# EAGLE design LogicBoard (EAGLE 9.6.2)

## Sheet 1 of 3
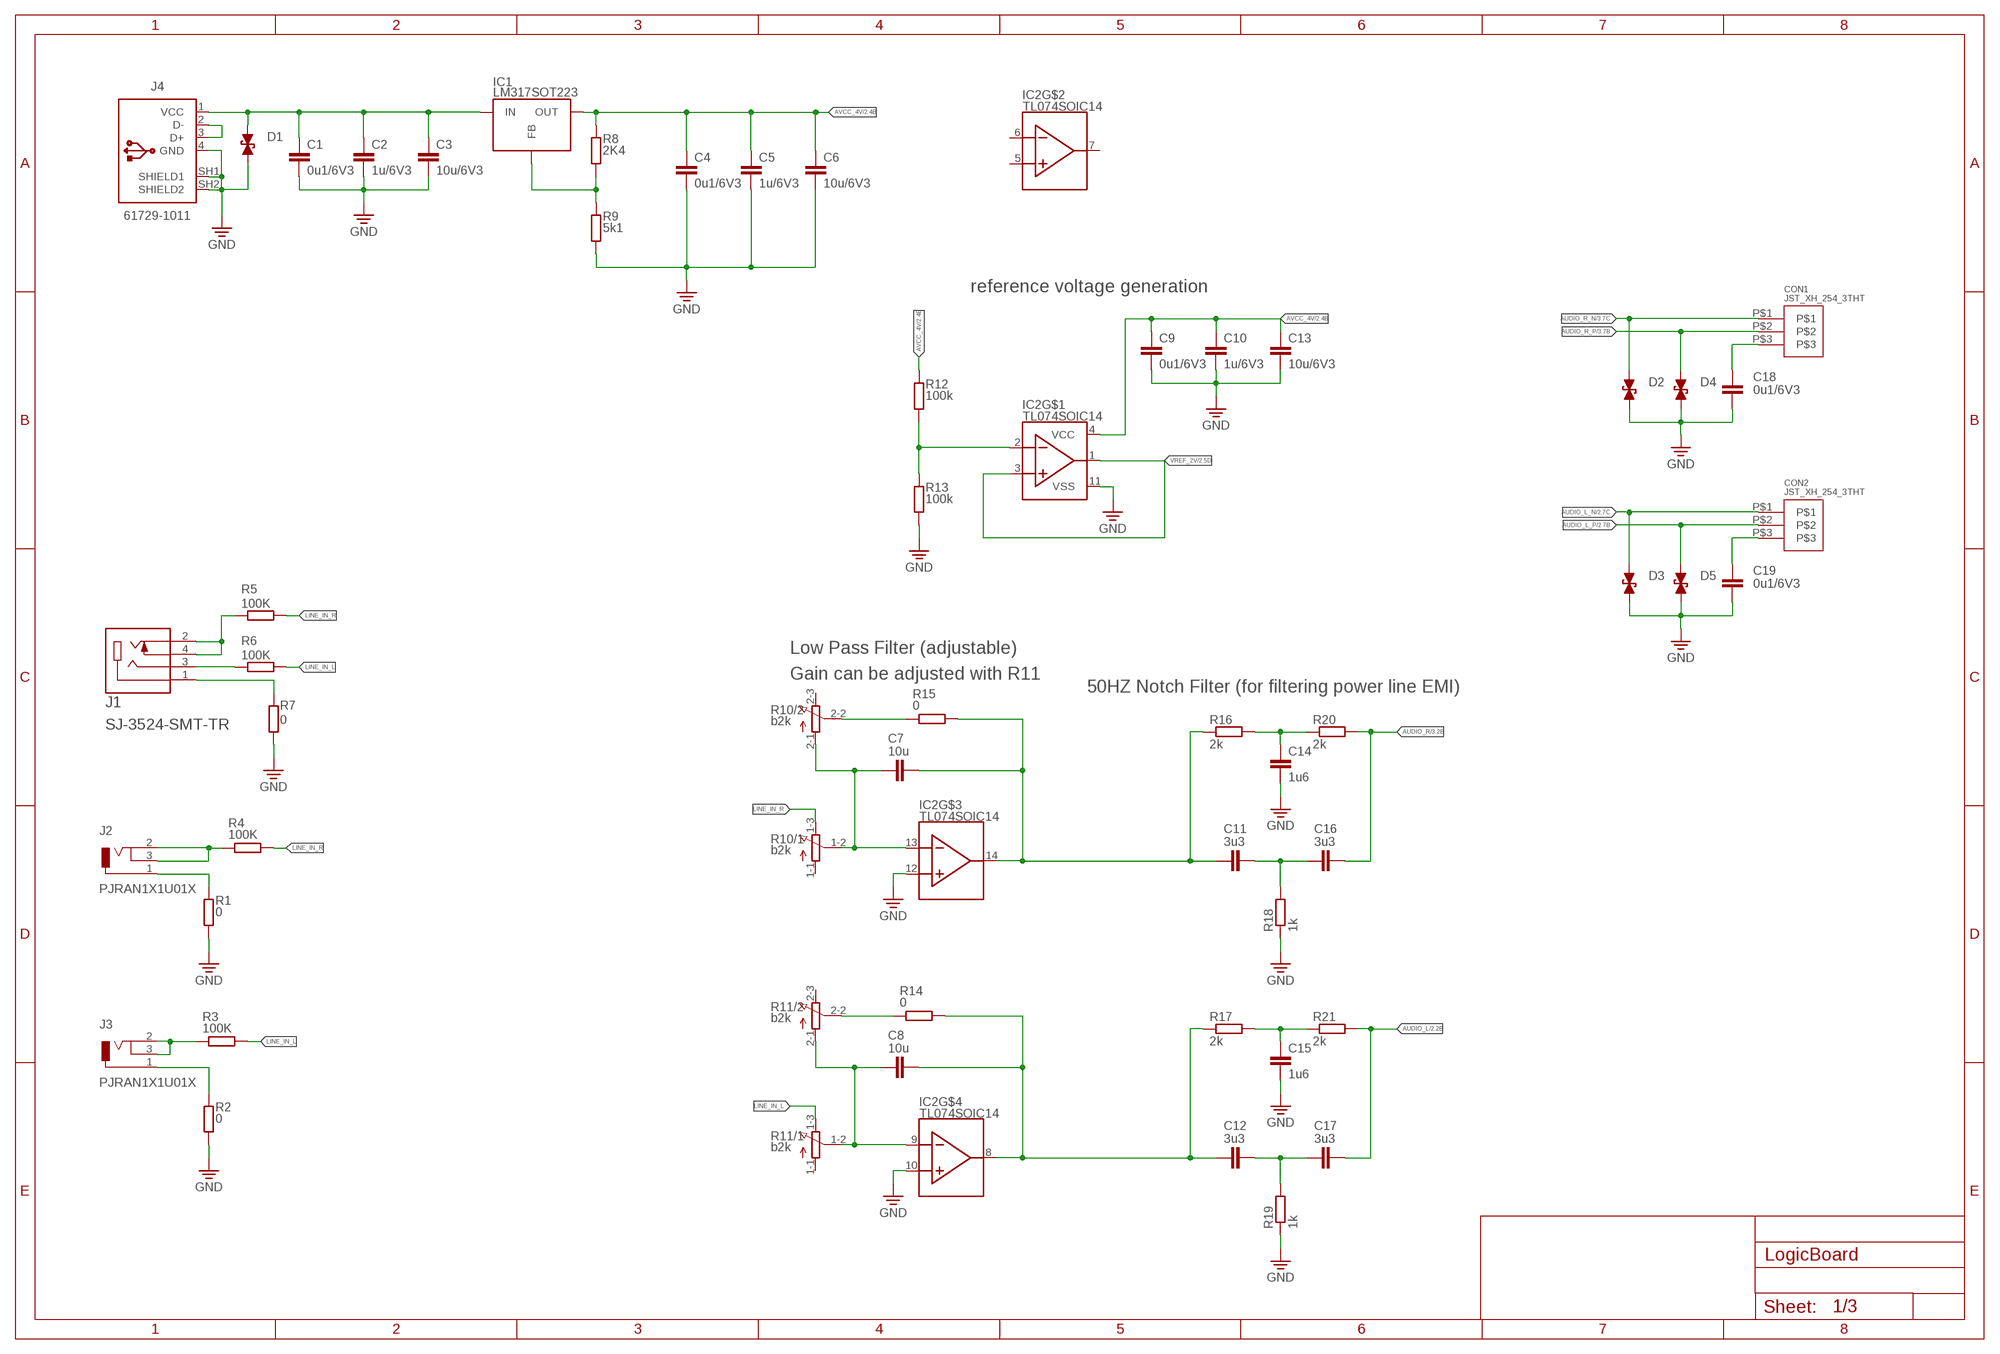
[diagram p0: schematic, sheet 1]

### Parts
C1  0u1/6V3  C-EUC1206  [C1206]
C2  1u/6V3  C-EUC1206  [C1206]
C3  10u/6V3  C-EUC1206  [C1206]
C4  0u1/6V3  C-EUC1206  [C1206]
C5  1u/6V3  C-EUC1206  [C1206]
C6  10u/6V3  C-EUC1206  [C1206]
C7  10u  C-EUC1206  [C1206]
C8  10u  C-EUC1206  [C1206]
C9  0u1/6V3  C-EUC1206  [C1206]
C10  1u/6V3  C-EUC1206  [C1206]
C11  3u3  C-EUC1206  [C1206]
C12  3u3  C-EUC1206  [C1206]
C13  10u/6V3  C-EUC1206  [C1206]
C14  1u6  C-EUC1206  [C1206]
C15  1u6  C-EUC1206  [C1206]
C16  3u3  C-EUC1206  [C1206]
C17  3u3  C-EUC1206  [C1206]
C18  0u1/6V3  C-EUC1206  [C1206]
C19  0u1/6V3  C-EUC1206  [C1206]
CON1  JST_XH_254_3THT  [JST_XH_254_3_THT]
CON2  JST_XH_254_3THT  [JST_XH_254_3_THT]
D1  DIODE_PGB-0603MP  [DIODE_PGB-0603MP]
D2  DIODE_PGB-0603MP  [DIODE_PGB-0603MP]
D3  DIODE_PGB-0603MP  [DIODE_PGB-0603MP]
D4  DIODE_PGB-0603MP  [DIODE_PGB-0603MP]
D5  DIODE_PGB-0603MP  [DIODE_PGB-0603MP]
IC1  LM317SOT223  [SOT230P700X180-4N]
IC2  TL074SOIC14  [SOIC127P600X175-14N]
J1  SJ-3524-SMT-TR  [SJ-3524-SMT-TR]
J2  PJRAN1X1U01X  [PJRAN1X1U01X]
J3  PJRAN1X1U01X  [PJRAN1X1U01X]
J4  61729-1011  [61729-1011BLF]
R1  0  R-EU_R0603  [R0603]
R2  0  R-EU_R0603  [R0603]
R3  100K  R-EU_R0603  [R0603]
R4  100K  R-EU_R0603  [R0603]
R5  100K  R-EU_R0603  [R0603]
R6  100K  R-EU_R0603  [R0603]
R7  0  R-EU_R0603  [R0603]
R8  2K4  R-EU_R0603  [R0603]
R9  5k1  R-EU_R0603  [R0603]
R10  b2k  3RP/1610G  [3RP/1610G]
R11  b2k  3RP/1610G  [3RP/1610G]
R12  100k  R-EU_R0603  [R0603]
R13  100k  R-EU_R0603  [R0603]
R14  0  R-EU_R0603  [R0603]
R15  0  R-EU_R0603  [R0603]
R16  2k  R-EU_R0603  [R0603]
R17  2k  R-EU_R0603  [R0603]
R18  1k  R-EU_R0603  [R0603]
R19  1k  R-EU_R0603  [R0603]
R20  2k  R-EU_R0603  [R0603]
R21  2k  R-EU_R0603  [R0603]

### Nets
AUDIO_L: C17.2 R21.2 ; also sheet 2
AUDIO_L_N: CON2.P$1 D3.2 ; also sheet 2
AUDIO_L_P: CON2.P$2 D5.2 ; also sheet 2
AUDIO_R: C16.2 R20.2 ; also sheet 3
AUDIO_R_N: CON1.P$1 D2.2 ; also sheet 3
AUDIO_R_P: CON1.P$2 D4.2 ; also sheet 3
AVCC_4V: C4.1 C5.1 C6.1 C9.1 C10.1 C13.1 IC1.2(OUT) IC2.4(VCC) R8.2 R12.2 ; also sheet 2,3
GND: C1.2 C2.2 C3.2 C4.2 C5.2 C6.2 C9.2 C10.2 C13.2 C14.2 C15.2 C18.1 C19.1 D1.1 D2.1 D3.1 D4.1 D5.1 IC2.10(IN+) IC2.11(VSS) IC2.12(IN+) J4.4(GND) J4.SH1(SHIELD1) J4.SH2(SHIELD2) R1.2 R2.2 R7.2 R9.1 R13.1 R18.1 R19.1 ; also sheet 2,3
L: J1.3 R6.1
LINE_IN_L: R3.2 R6.2 R11.1-3(/1:E)
LINE_IN_R: R4.2 R5.2 R10.1-3(/1:E)
N$1: C8.1 IC2.9(IN-) R11.1-2(/1:S) R11.2-1(/2:A)
N$2: C7.1 IC2.13(IN-) R10.1-2(/1:S) R10.2-1(/2:A)
N$3: C8.2 C12.1 IC2.8(OUT) R14.2 R17.1
N$4: C7.2 C11.1 IC2.14(OUT) R15.2 R16.1
N$5: C14.1 R16.2 R20.1
N$6: R10.2-2(/2:S) R15.1
N$7: C15.1 R17.2 R21.1
N$8: C11.2 C16.1 R18.2
N$9: C12.2 C17.1 R19.2
N$10: J2.2 J2.3 R4.1
N$11: J3.2 J3.3 R3.1
N$12: IC2.2(IN-) R12.1 R13.2
N$37: C18.2 CON1.P$3
N$38: J4.2(D-) J4.3(D+)
N$39: J3.1 R2.1
N$40: J2.1 R1.1
N$41: C1.1 C2.1 C3.1 D1.2 IC1.3(IN) J4.1(VCC)
N$42: R11.2-2(/2:S) R14.1
N$43: IC1.1(FB) R8.1 R9.2
N$44: C19.2 CON2.P$3
R: J1.2 J1.4 R5.1
SCHIRMUNG: J1.1 R7.1
VREF_2V: IC2.1(OUT) IC2.3(IN+) ; also sheet 2,3
Unconnected: IC2.5(IN+) IC2.6(IN-) IC2.7(OUT) R10.1-1(/1:A) R10.2-3(/2:E) R11.1-1(/1:A) R11.2-3(/2:E)

### Notes on the sheet
- reference voltage generation
- Low Pass Filter (adjustable)
- Gain can be adjusted with R11
- 50HZ Notch Filter (for filtering power line EMI)

## Sheet 2 of 3
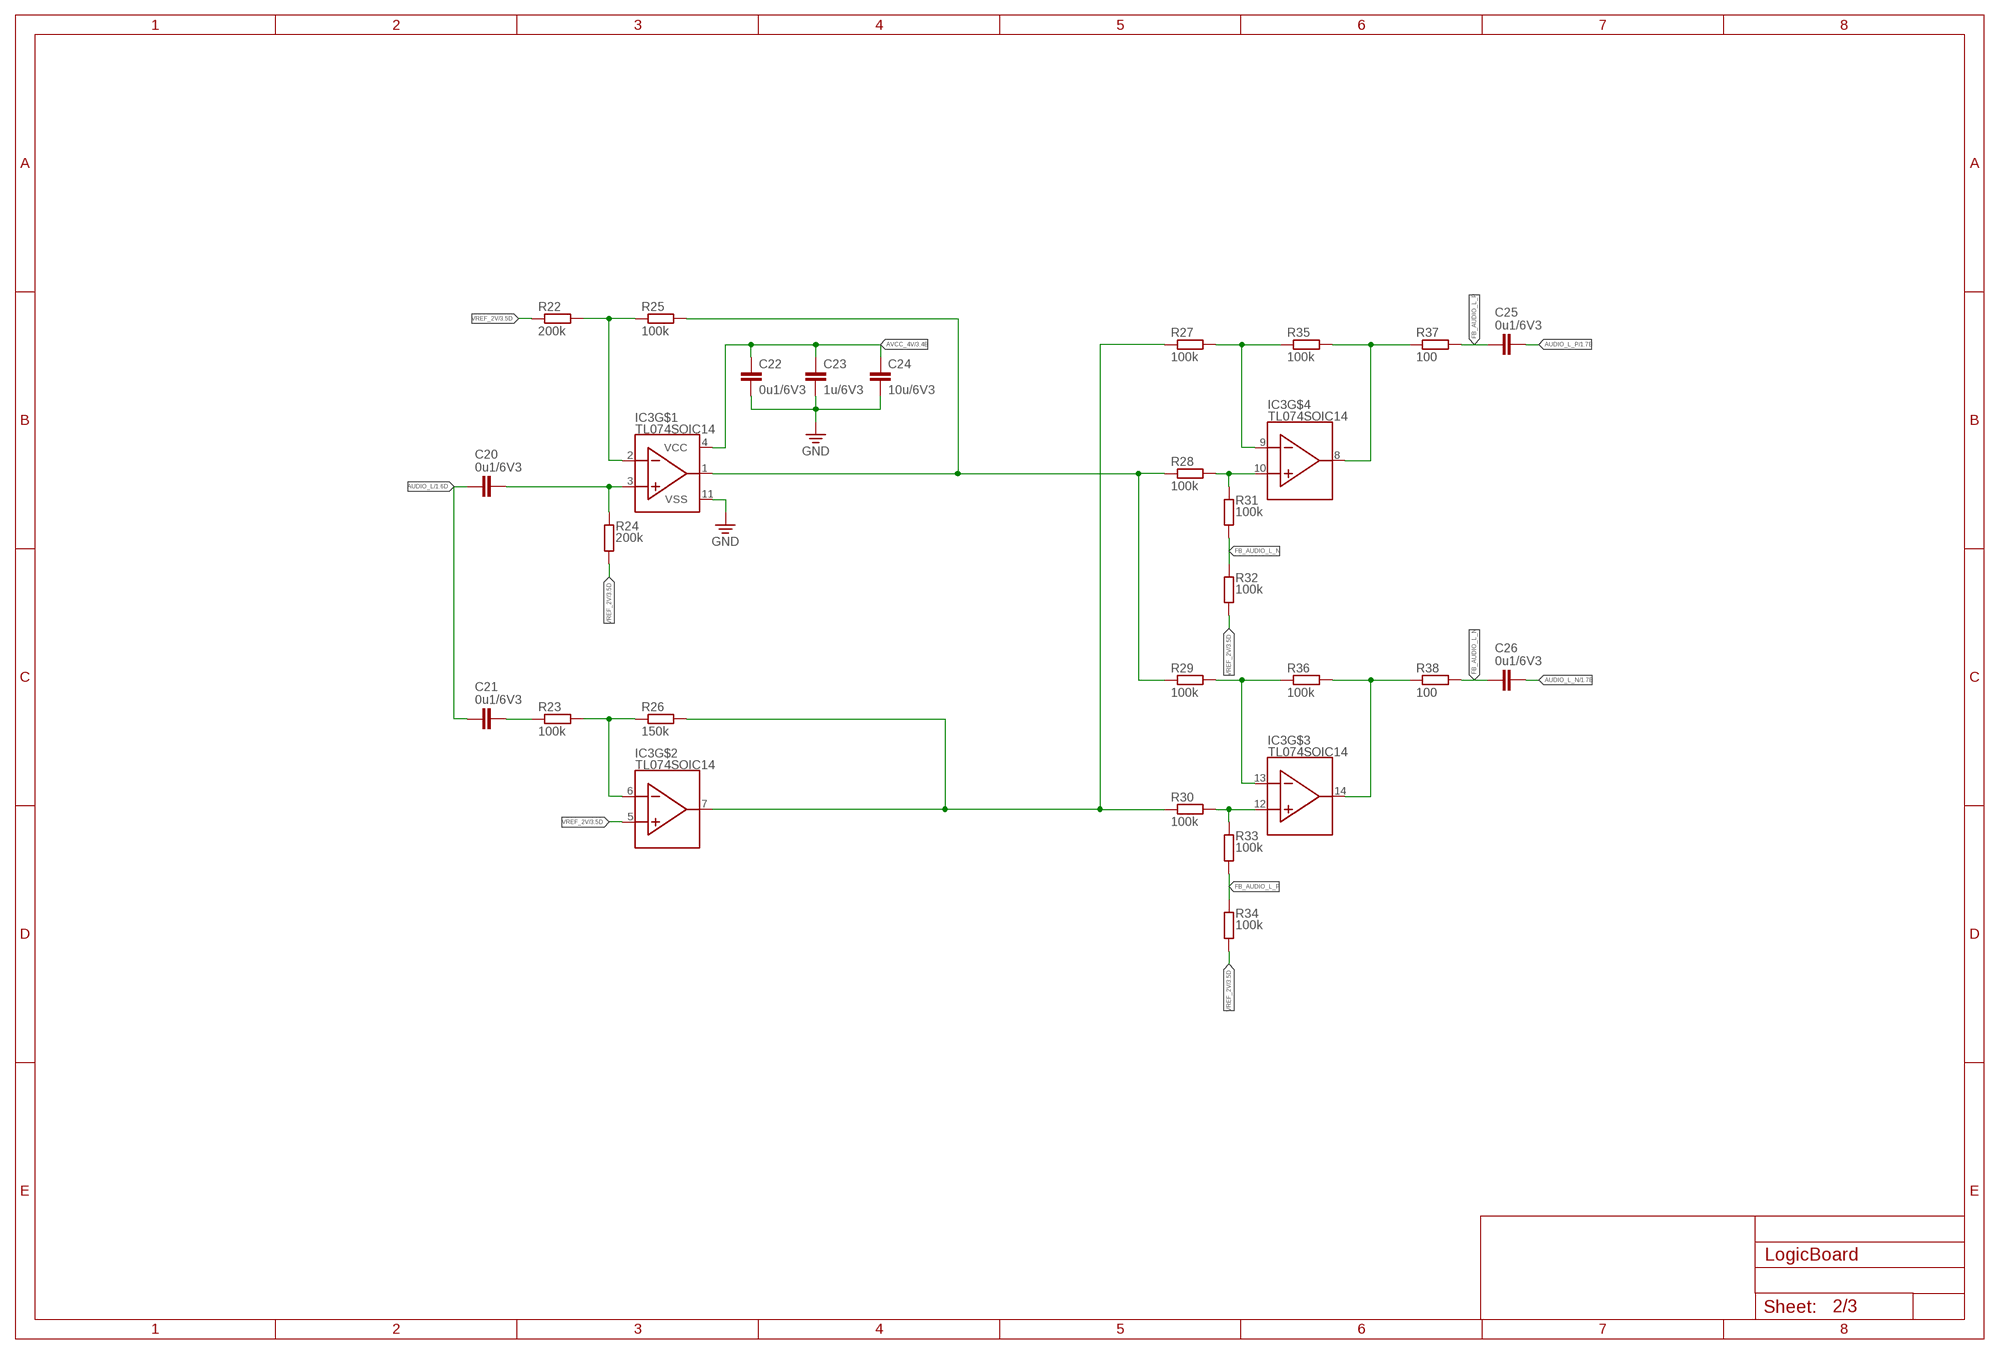
[diagram p1: schematic, sheet 2]

### Parts
C20  0u1/6V3  C-EUC1206  [C1206]
C21  0u1/6V3  C-EUC1206  [C1206]
C22  0u1/6V3  C-EUC1206  [C1206]
C23  1u/6V3  C-EUC1206  [C1206]
C24  10u/6V3  C-EUC1206  [C1206]
C25  0u1/6V3  C-EUC1206  [C1206]
C26  0u1/6V3  C-EUC1206  [C1206]
IC3  TL074SOIC14  [SOIC127P600X175-14N]
R22  200k  R-EU_R0603  [R0603]
R23  100k  R-EU_R0603  [R0603]
R24  200k  R-EU_R0603  [R0603]
R25  100k  R-EU_R0603  [R0603]
R26  150k  R-EU_R0603  [R0603]
R27  100k  R-EU_R0603  [R0603]
R28  100k  R-EU_R0603  [R0603]
R29  100k  R-EU_R0603  [R0603]
R30  100k  R-EU_R0603  [R0603]
R31  100k  R-EU_R0603  [R0603]
R32  100k  R-EU_R0603  [R0603]
R33  100k  R-EU_R0603  [R0603]
R34  100k  R-EU_R0603  [R0603]
R35  100k  R-EU_R0603  [R0603]
R36  100k  R-EU_R0603  [R0603]
R37  100  R-EU_R0603  [R0603]
R38  100  R-EU_R0603  [R0603]

### Nets
AUDIO_L: C20.2 C21.2 ; also sheet 1
AUDIO_L_N: C26.1 ; also sheet 1
AUDIO_L_P: C25.1 ; also sheet 1
AVCC_4V: C22.1 C23.1 C24.1 IC3.4(VCC) ; also sheet 1,3
FB_AUDIO_L_N: C26.2 R31.2 R32.1 R38.2
FB_AUDIO_L_P: C25.2 R33.2 R34.1 R37.2
GND: C22.2 C23.2 C24.2 IC3.11(VSS) ; also sheet 1,3
N$13: IC3.6(IN-) R23.2 R26.1
N$14: IC3.2(IN-) R22.2 R25.1
N$15: IC3.9(IN-) R27.2 R35.1
N$16: IC3.8(OUT) R35.2 R37.1
N$17: IC3.10(IN+) R28.2 R31.1
N$18: IC3.13(IN-) R29.2 R36.1
N$19: IC3.14(OUT) R36.2 R38.1
N$20: IC3.12(IN+) R30.2 R33.1
N$21: IC3.1(OUT) R25.2 R28.1 R29.1
N$22: IC3.7(OUT) R26.2 R27.1 R30.1
N$23: C20.1 IC3.3(IN+) R24.2
N$24: C21.1 R23.1
VREF_2V: IC3.5(IN+) R22.1 R24.1 R32.2 R34.2 ; also sheet 1,3

## Sheet 3 of 3
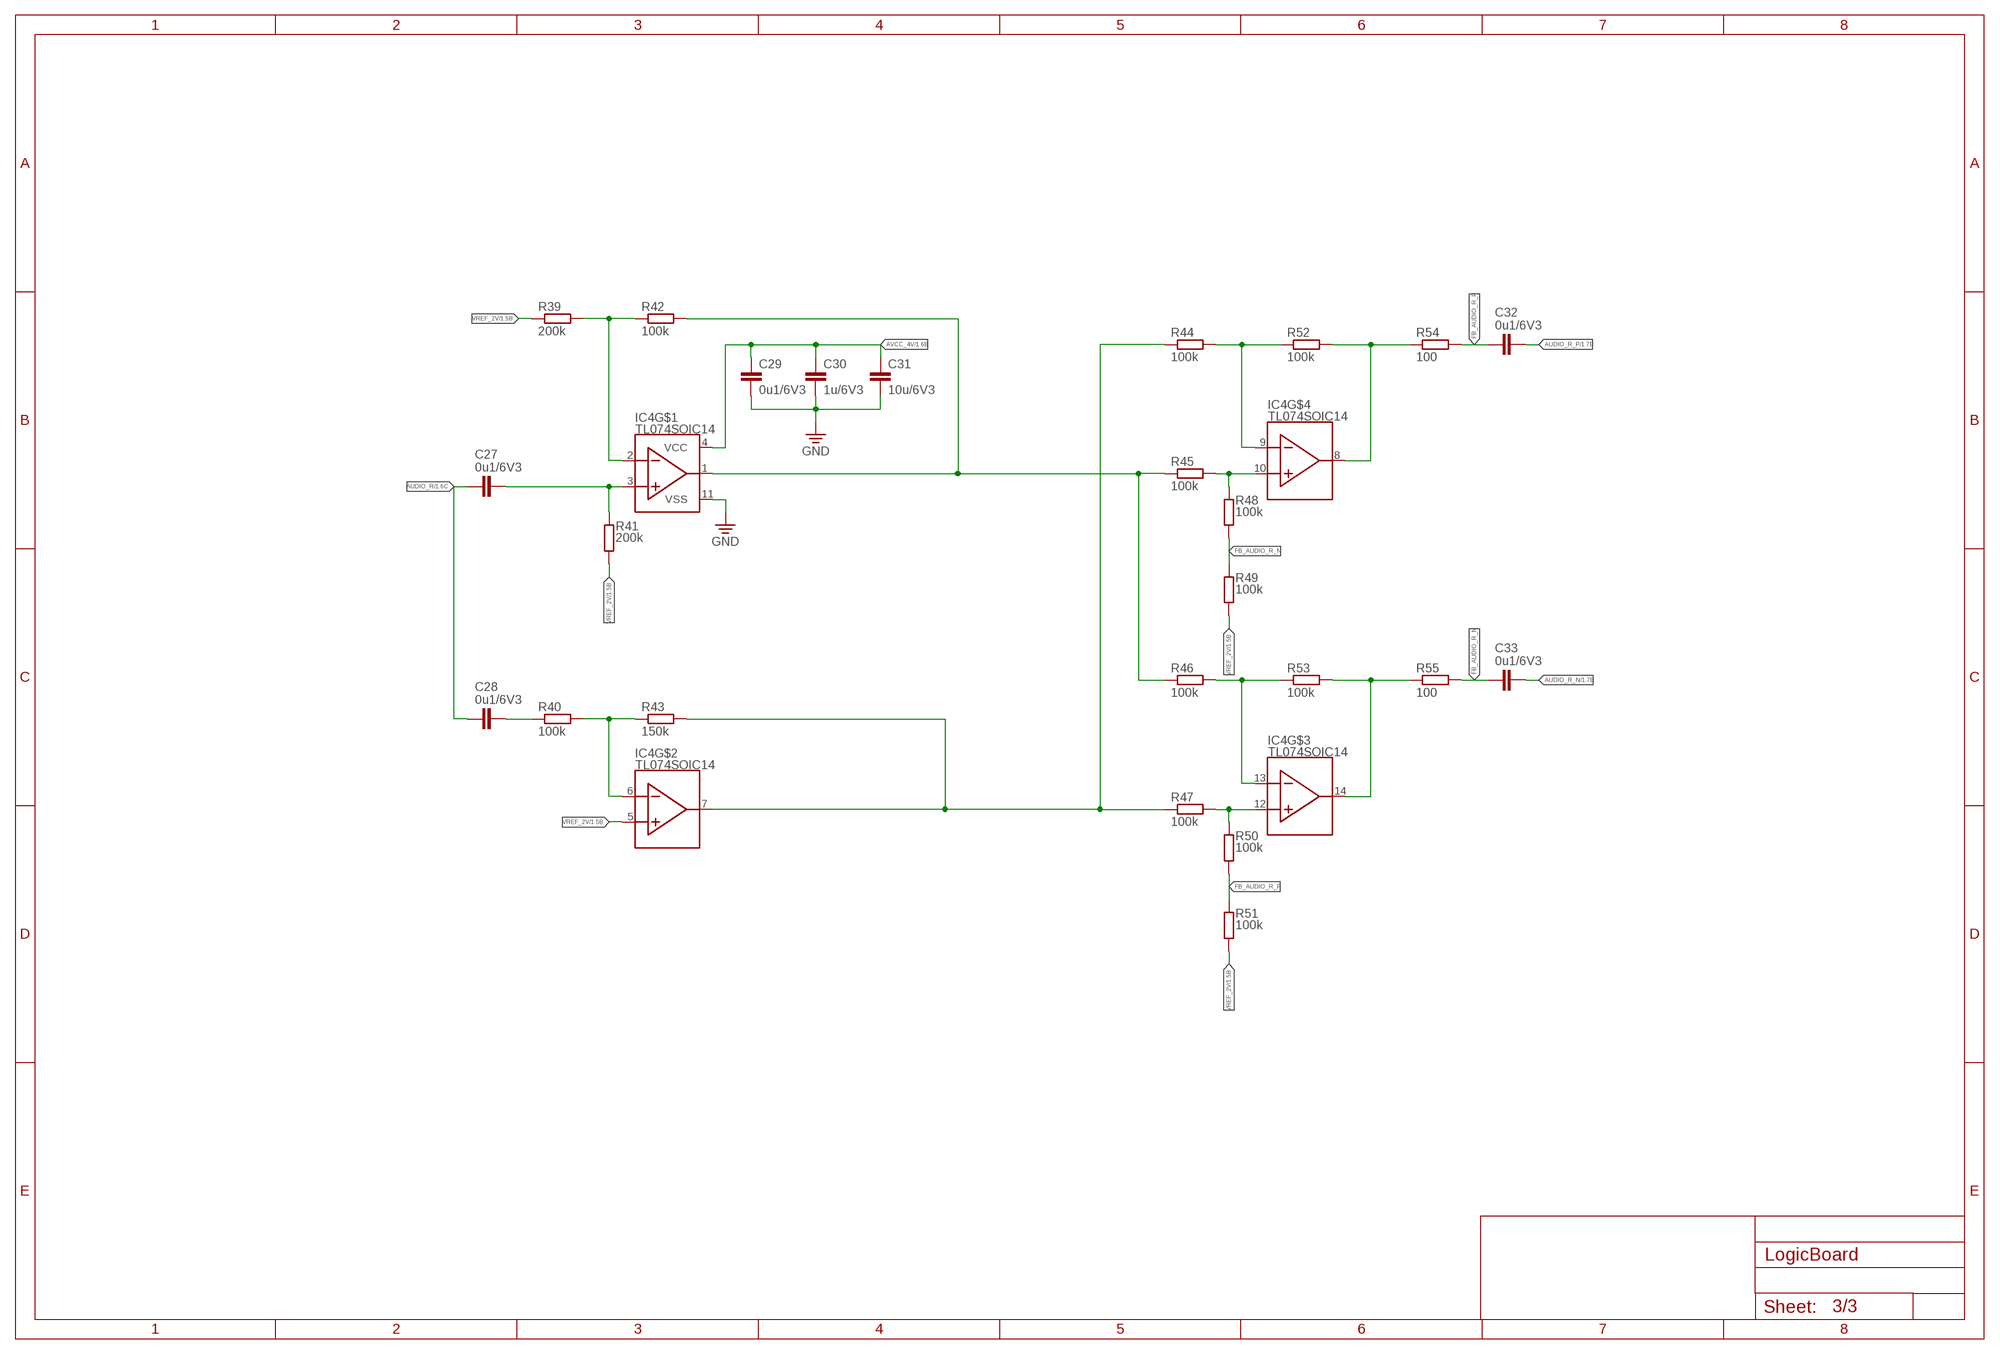
[diagram p2: schematic, sheet 3]

### Parts
C27  0u1/6V3  C-EUC1206  [C1206]
C28  0u1/6V3  C-EUC1206  [C1206]
C29  0u1/6V3  C-EUC1206  [C1206]
C30  1u/6V3  C-EUC1206  [C1206]
C31  10u/6V3  C-EUC1206  [C1206]
C32  0u1/6V3  C-EUC1206  [C1206]
C33  0u1/6V3  C-EUC1206  [C1206]
IC4  TL074SOIC14  [SOIC127P600X175-14N]
R39  200k  R-EU_R0603  [R0603]
R40  100k  R-EU_R0603  [R0603]
R41  200k  R-EU_R0603  [R0603]
R42  100k  R-EU_R0603  [R0603]
R43  150k  R-EU_R0603  [R0603]
R44  100k  R-EU_R0603  [R0603]
R45  100k  R-EU_R0603  [R0603]
R46  100k  R-EU_R0603  [R0603]
R47  100k  R-EU_R0603  [R0603]
R48  100k  R-EU_R0603  [R0603]
R49  100k  R-EU_R0603  [R0603]
R50  100k  R-EU_R0603  [R0603]
R51  100k  R-EU_R0603  [R0603]
R52  100k  R-EU_R0603  [R0603]
R53  100k  R-EU_R0603  [R0603]
R54  100  R-EU_R0603  [R0603]
R55  100  R-EU_R0603  [R0603]

### Nets
AUDIO_R: C27.2 C28.2 ; also sheet 1
AUDIO_R_N: C33.1 ; also sheet 1
AUDIO_R_P: C32.1 ; also sheet 1
AVCC_4V: C29.1 C30.1 C31.1 IC4.4(VCC) ; also sheet 1,2
FB_AUDIO_R_N: C33.2 R48.2 R49.1 R55.2
FB_AUDIO_R_P: C32.2 R50.2 R51.1 R54.2
GND: C29.2 C30.2 C31.2 IC4.11(VSS) ; also sheet 1,2
N$25: IC4.6(IN-) R40.2 R43.1
N$26: IC4.2(IN-) R39.2 R42.1
N$27: IC4.9(IN-) R44.2 R52.1
N$28: IC4.8(OUT) R52.2 R54.1
N$29: IC4.10(IN+) R45.2 R48.1
N$30: IC4.13(IN-) R46.2 R53.1
N$31: IC4.14(OUT) R53.2 R55.1
N$32: IC4.12(IN+) R47.2 R50.1
N$33: IC4.1(OUT) R42.2 R45.1 R46.1
N$34: IC4.7(OUT) R43.2 R44.1 R47.1
N$35: C27.1 IC4.3(IN+) R41.2
N$36: C28.1 R40.1
VREF_2V: IC4.5(IN+) R39.1 R41.1 R49.2 R51.2 ; also sheet 1,2

## Library data of the parts
C1-C33 = rcl:C-EU: CAPACITOR, European symbol; SPICEPREFIX: C
CON1 CON2 = LARS_CONN v48:JST_XH_254_3
D1-D5 = 52101-101-REV-A_v16:DIODE_PGB-0603: ESD SUPPRESSOR
IC1 = LARS_POWER:LM317
IC2-IC4 = LARS_AUDIO:TL074*: TL07xx Low-Noise FET-Input Operational Amplifiers Features High slew rate: 20 V/μs (TL07xH, typ) Low offset voltage: 1 mV (TL07xH, typ) Low offset voltage drift: 2 μV/°C Low power consumption: 940 μA/ch (TL07xH, typ) Wide common-mode and differential voltage ranges – Common-mode input voltage range includes VCC+ Low input bias and offset currents Low noise: Vn = 18 nV/√Hz (typ) at f = 1 kHz Output short-circuit protection Low total harmonic distortion: 0.003% (typ) Wide supply voltage: ±2.25 V to ±20 V, 4.5 V to 40 V 2 Applications Solar energy: string and central inverter Motor drives: AC and servo drive control and power stage modules Single phase online UPS Three phase UPS Pro audio mixers Battery test equipment 3 Description The TL07xH (TL071H, TL072H, and TL074H) family of devices are the next-generation versions of the industry-standard TL07x (TL071, TL072, and TL074) devices. These devices provide outstanding value for cost-sensitive applications, with features including low offset (1 mV, typical), high slew rate (20 V/μs), and common-mode input to the positive supply. High ESD (1.5 kV, HBM), integrated EMI and RF filters, and operation across the full –40°C to 125°C enable the TL07xH devices to be used in the most rugged and demanding applications. DATASHEET: https://www.ti.com/lit/ds/symlink/tl074h.pdf?ts=1661946856709&ref_url=https%253A%252F%252Fwww.ti.com%252Fproduct%252FTL074H
J1 = Audio Connectors:SJ-3524-SMT-TR: CONN JACK STEREO 3.5MM SMD R/A Manufacturer's datasheet <https://www.cuidevices.com/product/resource/sj-352x-smt.pdf>; CREATED_BY: PCBLayout.com; DIGIKEY_PARTNO: CP-3524SJTR-ND; MANUFCATURER: CUI Devices; MPN: SJ-3524-SMT-TR
J2 J3 = Connector:PJRAN1X1U01X: CONN RCA JACK MONO 3.2MM R/A Manufacturer's datasheet <http://www.switchcraft.com/Drawings/pjran1x1u__x_series_cd.pdf>; CREATED_BY: PCBLayout.com; DIGIKEY_PART_NUMBER: PJRAN1X1U01X-ND; MANUFACTURER: Switchcraft Inc.; MPN: PJRAN1X1U01X
J4 = Connector_USB:61729-1011: USB(2.0) Type-B, RCPT, 4POS, THT-R/A Datasheet <https://www.amphenol-icc.com/media/wysiwyg/files/drawing/61729.pdf>; CATEGORY: Connector; CONTACTS: 4; CURRENT_RATING: 1A; DESCRIPTION: CONN RCPT USB2.0 TYPEB 4POS R/A; GENDER: Receptacle; MANUFACTURER: Amphenol ICC (FCI); MOUNT_TYPE: R/A; MPN: 61729-1011BLF; OPERATING_TEMP: -55°C to 85°C; PART_STATUS: Active; ROHS_COMPLIANT: RoHS Compliant; SERIES: 61729; SUB-CATEGORY: USB; TYPE: USB-B
R1-R9 R12-R55 = rcl:R-EU_: RESISTOR, European symbol; SPICEPREFIX: R
R10 R11 = pot:3RP/1610G: 16mm Potentiometer two level Source: http://www.alphapotentiometers.net/html/16mm_pot_2.html

## Board
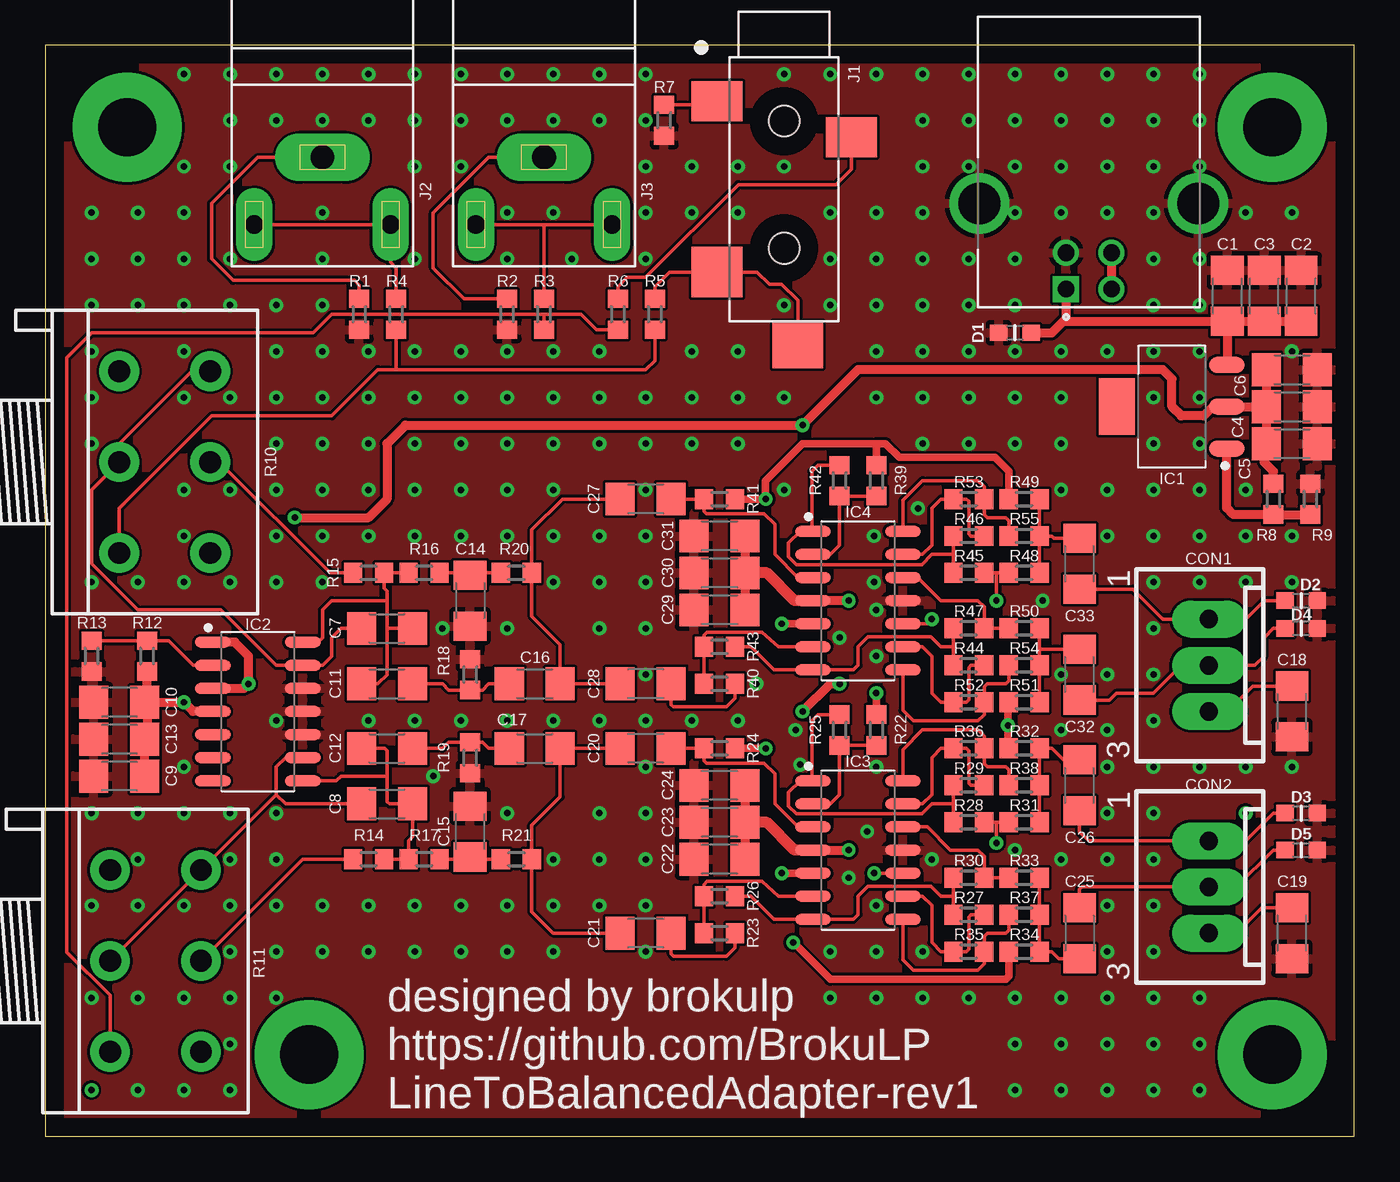
[diagram p3: board, top side]
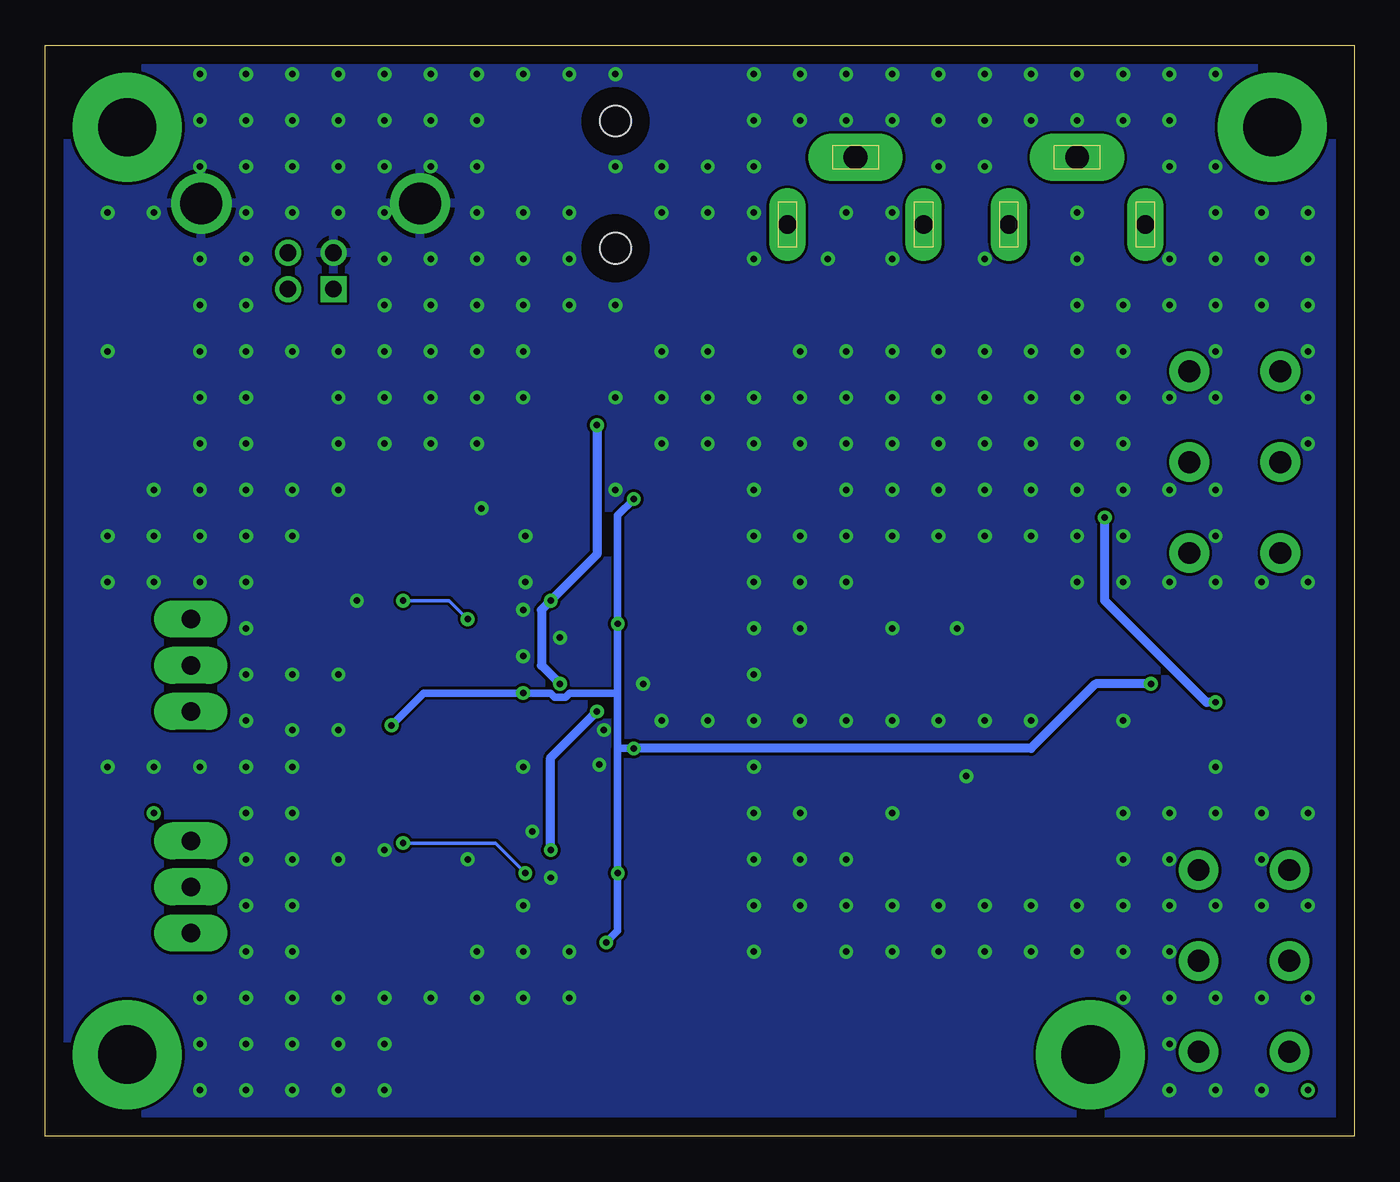
[diagram p4: board, bottom side, seen from below]

Size 72 x 60 mm. Coordinates in mm from the lower left corner, seen from the top.
Outline: 0,0 72,0 72,60 0,60 0,0
Copper layers (1*16): Top 0.035mm / dielectric 1.5mm / Bottom 0.035mm
Design rules "default": minimum track width 6mil, minimum drill 0.35mm, track to track 6mil, track to pad 6mil, pad to pad 6mil, via to via 6mil, smd to smd 6mil, copper to edge 40mil, drill to drill 6mil, minimum pad ring 10mil, minimum via ring 8mil, stop-mask expansion 4mil, vias tented up to drill 0mil, thermal gap 10mil

### Footprints (pad centres in the part's own frame; a part is rotated, then mirrored left to right if it is on the bottom)
C1206 = smd 1.6 x 1.8: 1 -1.4,0; 2 1.4,0
JST_XH_254_3_THT = drill 1.016 pad 2.032 long: P$1 0,2.54; P$2 0,0; P$3 0,-2.54
DIODE_PGB-0603MP = smd 0.95 x 0.9: 1 -0.889,0; 2 0.889,0
SOT230P700X180-4N = smd 1.965 x 0.889: 1 -3.023,2.3; 2 -3.023,0; 3 -3.023,-2.3 | smd 1.965 x 3.11: 4 3.023,0
SOIC127P600X175-14N = smd 1.968 x 0.599: 1 -2.473,3.81; 2 -2.473,2.54; 3 -2.473,1.27; 4 -2.473,0; 5 -2.473,-1.27; 6 -2.473,-2.54; 7 -2.473,-3.81; 8 2.473,-3.81; 9 2.473,-2.54; 10 2.473,-1.27; 11 2.473,0; 12 2.473,1.27; 13 2.473,2.54; 14 2.473,3.81
SJ-3524-SMT-TR = smd 2.2 x 2.8: 1 -3.6,-3.7; 3 -1.6,3.7 | smd 2.8 x 2.8: 2 5.8,-3.7 | smd 2.6 x 2.8: 4 9.8,0.75 | hole 1.7: -2.5,0; 4.5,0
PJRAN1X1U01X = drill 1.3 pad 2.6 long: 1 0,0 | drill 1 pad 2 long: 2 3.75,3.7; 3 -3.75,3.7
61729-1011BLF = drill 0.92 square: 1 1.25,4.71 | drill 0.92: 2 -1.25,4.71; 3 -1.25,2.71; 4 1.25,2.71 | drill 2.3: SH1 -6.02,0; SH2 6.02,0
R0603 = smd 1 x 1.1: 1 -0.85,0; 2 0.85,0
3RP/1610G = drill 1.2 pad 2.184: 1-1 -5,0; 1-2 0,0; 1-3 5,0; 2-1 -5,5; 2-2 0,5; 2-3 5,5

### Placement (x,y rotation side)
C1  65.02,46.23 90 top
C2  69.09,46.23 90 top
C3  67.06,46.23 90 top
C4  68.58,42.16 0 top
C5  68.58,38.1 0 top
C6  68.58,40.13 0 top
C7  18.8,27.94 0 top
C8  18.8,18.29 0 top
C9  4.06,19.81 180 top
C10  4.06,23.88 180 top
C11  18.8,24.89 0 top
C12  18.8,21.34 0 top
C13  4.06,21.84 180 top
C14  23.37,29.46 270 top
C15  23.37,16.76 90 top
C16  26.92,24.89 0 top
C17  26.92,21.34 0 top
C18  68.58,23.37 90 top
C19  68.58,11.18 90 top
C20  33.02,21.34 180 top
C21  33.02,11.18 180 top
C22  37.08,15.24 180 top
C23  37.08,17.27 180 top
C24  37.08,19.3 180 top
C25  56.9,11.18 270 top
C26  56.9,19.3 90 top
C27  33.02,35.05 180 top
C28  33.02,24.89 180 top
C29  37.08,28.96 180 top
C30  37.08,30.99 180 top
C31  37.08,33.02 180 top
C32  56.9,25.4 90 top
C33  56.9,31.5 90 top
CON1  64.01,25.91 0 top
CON2  64.01,13.72 0 top
D1  53.34,44.2 0 top
D2  69.09,29.46 180 top
D3  69.09,17.78 180 top
D4  69.09,27.94 180 top
D5  69.09,15.75 180 top
IC1  61.98,40.13 180 top
IC2  11.68,23.37 0 top
IC3  44.7,15.75 0 top
IC4  44.7,29.46 0 top
J1  40.64,53.34 270 top
J2  15.24,53.85 180 top
J3  27.43,53.85 180 top
J4  57.4,51.31 180 top
R1  17.27,45.21 270 top
R2  25.4,45.21 270 top
R3  27.43,45.21 270 top
R4  19.3,45.21 270 top
R5  33.53,45.21 270 top
R6  31.5,45.21 270 top
R7  34.04,55.88 270 top
R8  67.56,35.05 90 top
R9  69.6,35.05 270 top
R10  4.06,37.08 270 top
R11  3.56,9.65 270 top
R12  5.59,26.42 270 top
R13  2.54,26.42 90 top
R14  17.78,15.24 0 top
R15  17.78,30.99 0 top
R16  20.83,30.99 0 top
R17  20.83,15.24 0 top
R18  23.37,25.4 270 top
R19  23.37,20.83 90 top
R20  25.91,30.99 0 top
R21  25.91,15.24 0 top
R22  45.72,22.35 270 top
R23  37.08,11.18 180 top
R24  37.08,21.34 180 top
R25  43.69,22.35 90 top
R26  37.08,13.21 0 top
R27  50.8,12.19 0 top
R28  50.8,17.27 0 top
R29  50.8,19.3 0 top
R30  50.8,14.22 0 top
R31  53.85,17.27 0 top
R32  53.85,21.34 180 top
R33  53.85,14.22 0 top
R34  53.85,10.16 180 top
R35  50.8,10.16 0 top
R36  50.8,21.34 0 top
R37  53.85,12.19 0 top
R38  53.85,19.3 0 top
R39  45.72,36.07 270 top
R40  37.08,24.89 180 top
R41  37.08,35.05 180 top
R42  43.69,36.07 90 top
R43  37.08,26.92 0 top
R44  50.8,25.91 0 top
R45  50.8,30.99 0 top
R46  50.8,33.02 0 top
R47  50.8,27.94 0 top
R48  53.85,30.99 0 top
R49  53.85,35.05 180 top
R50  53.85,27.94 0 top
R51  53.85,23.88 180 top
R52  50.8,23.88 0 top
R53  50.8,35.05 0 top
R54  53.85,25.91 0 top
R55  53.85,33.02 0 top

### Tracks (layer width: path | path; a pad name or v marks a point on that pad's centre or on a via)
AUDIO_L
  Top 0.203: C20.2 C17.2 28.32,18.67 26.76,17.11 R21.2 26.76,12.36 27.94,11.18 C21.2
AUDIO_L_N
  Top 0.203: C26.1 56.9,16.76 57.4,16.26 CON2.P$1 66.04,16.26 67.56,17.78 D3.2
AUDIO_L_P
  Top 0.203: D5.2 67.56,15.75 65.53,13.72 CON2.P$2 57.02,13.72 56.9,13.59 C25.1
AUDIO_R
  Top 0.203: C28.2 C16.2 28.32,27.05 26.76,28.61 R20.2 26.76,33.36 28.45,35.05 C27.2
AUDIO_R_N
  Top 0.203: C33.1 59.82,30.1 61.47,28.45 CON1.P$1 66.04,28.45 67.06,29.46 D2.2
AUDIO_R_P
  Top 0.203: C32.1 58.54,24 58.93,24.38 60.96,24.38 62.48,25.91 CON1.P$2 66.55,25.91 67.06,26.42 67.06,27.43 67.56,27.94 D4.2
AVCC_4V  (via drill 0.36)
  Top 0.508: C24.1 C23.1 C22.1 | C31.1 C30.1 C29.1 | C4.1 C6.1 | C6.1 C5.1 67.06,37.98 67.06,37.08 67.56,36.58 R8.2 | C6.1 IC1.2 64.24,40.13 63.73,39.62 62.48,39.62 61.98,40.13 61.98,41.66 61.47,42.16 44.7,42.16 v41.66,39.12 19.81,39.12 18.8,38.1 18.8,35.05 17.78,34.04 v13.72,34.04 | C10.1 5.59,23.75 5.59,21.34 5.46,21.46 | 5.46,21.46 C13.1 | C9.1 5.46,21.46 | R12.2 5.59,24 C10.1 | C10.1 v7.62,23.88 8.13,23.37 IC2.4 | v44.2,29.46 IC4.4 | IC3.4 v44.2,15.75 | v41.66,23.37 43.18,24.89 v43.69,24.89
  Top 0.61: IC3.4 41.22,15.75 39.69,17.27 C23.1 | IC4.4 41.22,29.46 39.69,30.99 C30.1
  Bottom 0.508: v41.66,39.12 41.66,32 v44.2,29.46 44.7,28.96 44.7,25.91 v43.69,24.89 | v44.2,15.75 44.2,20.83 v41.66,23.37 | v13.72,34.04 13.72,29.46 8.13,23.88 v7.62,23.88
FB_AUDIO_L_N
  Top 0.203: R31.2 R38.2 R32.1 55.37,21.34 56,20.7 C26.2
FB_AUDIO_L_P
  Top 0.203: R33.2 R37.2 R34.1 55.37,10.16 55.76,9.78 C25.2
FB_AUDIO_R_N
  Top 0.203: R55.2 R49.1 | R48.2 R55.2 | C33.2 55.5,32.9 55.37,33.02 R55.2
FB_AUDIO_R_P
  Top 0.203: 54.7,26.8 R54.2 R51.1 | C32.2 54.7,26.8 | R50.2 54.7,26.8
GND  (via drill 0.36)
  other vias: 7.62,58.42 10.16,58.42 12.7,58.42 15.24,58.42 17.78,58.42 20.32,58.42 22.86,58.42 25.4,58.42 27.94,58.42 30.48,58.42 33.02,58.42 40.64,58.42 43.18,58.42 45.72,58.42 48.26,58.42 50.8,58.42 53.34,58.42 55.88,58.42 58.42,58.42 60.96,58.42 63.5,58.42 10.16,55.88 12.7,55.88 15.24,55.88 17.78,55.88 20.32,55.88 22.86,55.88 25.4,55.88 27.94,55.88 30.48,55.88 33.02,55.88 48.26,55.88 50.8,55.88 53.34,55.88 55.88,55.88 58.42,55.88 60.96,55.88 63.5,55.88 7.62,53.34 10.16,53.34 20.32,53.34 22.86,53.34 33.02,53.34 35.56,53.34 38.1,53.34 40.64,53.34 48.26,53.34 50.8,53.34 53.34,53.34 55.88,53.34 58.42,53.34 60.96,53.34 63.5,53.34 7.62,50.8 15.24,50.8 25.4,50.8 27.94,50.8 33.02,50.8 35.56,50.8 38.1,50.8 43.18,50.8 45.72,50.8 48.26,50.8 53.34,50.8 55.88,50.8 58.42,50.8 60.96,50.8 66.04,50.8 7.62,48.26 10.16,48.26 15.24,48.26 20.32,48.26 25.4,48.26 28.96,48.26 33.02,48.26 43.18,48.26 45.72,48.26 48.26,48.26 50.8,48.26 53.34,48.26 60.96,48.26 63.5,48.26 7.62,45.72 10.16,45.72 12.7,45.72 15.24,45.72 40.64,45.72 43.18,45.72 45.72,45.72 48.26,45.72 50.8,45.72 53.34,45.72 60.96,45.72 63.5,45.72 7.62,43.18 12.7,43.18 15.24,43.18 17.78,43.18 20.32,43.18 22.86,43.18 25.4,43.18 27.94,43.18 30.48,43.18 35.56,43.18 38.1,43.18 45.72,43.18 48.26,43.18 50.8,43.18 53.34,43.18 55.88,43.18 58.42,43.18 60.96,43.18 63.5,43.18 68.58,50.8 7.62,40.64 10.16,40.64 12.7,40.64 15.24,40.64 17.78,40.64 20.32,40.64 22.86,40.64 25.4,40.64 27.94,40.64 30.48,40.64 33.02,40.64 35.56,40.64 38.1,40.64 40.64,40.64 45.72,40.64 48.26,40.64 50.8,40.64 53.34,40.64 55.88,40.64 60.96,40.64 63.5,40.64 68.58,43.18 5.08,45.72 5.08,48.26 12.7,38.1 15.24,38.1 17.78,38.1 20.32,38.1 22.86,38.1 25.4,38.1 27.94,38.1 30.48,38.1 33.02,38.1 35.56,38.1 38.1,38.1 48.26,38.1 50.8,38.1 53.34,38.1 55.88,38.1 60.96,38.1 63.5,38.1 5.08,50.8 7.62,35.56 10.16,35.56 12.7,35.56 15.24,35.56 17.78,35.56 20.32,35.56 22.86,35.56 25.4,35.56 27.94,35.56 33.02,35.56 40.64,35.56 48.01,34.54 66.04,35.56 55.88,35.56 58.42,35.56 60.96,35.56 63.5,35.56 7.62,33.02 12.7,33.02 15.24,33.02 17.78,33.02 20.32,33.02 22.86,33.02 25.4,33.02 27.94,33.02 30.48,33.02 33.02,33.02 45.59,33.02 68.58,33.02 66.04,33.02 58.42,33.02 60.96,33.02 63.5,33.02 5.08,30.48 7.62,30.48 10.16,30.48 12.7,30.48 15.24,30.48 27.94,30.48 30.48,30.48 33.02,30.48 45.59,30.48 68.58,30.48 66.04,30.48 54.86,29.46 60.96,30.48 63.5,30.48 21.84,27.94 25.4,27.94 30.48,27.94 33.02,27.94 43.69,27.43 45.72,28.96 60.96,27.94 12.7,22.86 17.78,22.86 20.32,22.86 22.86,22.86 25.4,22.86 27.94,22.86 30.48,22.86 33.02,22.86 35.56,22.86 38.1,22.86 41.27,22.35 55.88,22.35 58.42,22.35 60.96,22.86 10.16,17.78 12.7,17.78 25.4,17.78 21.34,19.81 30.48,17.78 33.02,17.78 58.42,17.78 60.96,17.78 10.16,15.24 12.7,15.24 27.94,15.24 30.48,15.24 33.02,15.24 48.77,15.24 53.34,15.75 55.88,15.24 58.42,15.24 60.96,15.24 7.62,7.62 10.16,5.08 7.62,17.78 5.08,17.78 53.34,5.08 55.88,5.08 58.42,5.08 60.96,5.08 63.5,5.08 10.16,7.62 12.7,7.62 7.62,20.32 43.18,7.62 45.72,7.62 48.26,7.62 50.8,7.62 53.34,7.62 55.88,7.62 58.42,7.62 60.96,7.62 63.5,7.62 10.16,10.16 12.7,10.16 15.24,10.16 17.78,10.16 20.32,10.16 22.86,10.16 25.4,10.16 27.94,10.16 33.02,10.16 10.16,12.7 12.7,12.7 15.24,12.7 17.78,12.7 20.32,12.7 22.86,12.7 25.4,12.7 27.94,12.7 30.48,12.7 33.02,12.7 5.08,2.54 7.62,2.54 10.16,2.54 7.62,12.7 53.34,2.54 55.88,2.54 58.42,2.54 60.96,2.54 63.5,2.54 2.54,17.78 2.54,12.7 2.54,7.62 5.08,15.24 5.08,12.7 5.08,7.62 60.96,10.16 58.42,10.16 48.26,10.16 45.72,10.16 43.18,10.16 60.96,12.7 58.42,12.7 45.72,12.7 33.02,20.32 41.53,20.45 45.72,20.32 58.42,20.32 60.96,20.32 63.5,20.32 66.04,20.32 68.58,20.32 33.02,25.4 39.12,24.89 45.72,26.42 55.88,25.4 58.42,25.4 60.96,25.4 2.54,50.8 2.54,48.26 2.54,45.72 2.54,43.18 2.54,40.64 2.54,38.1 2.54,30.48 44.2,14.22 45.21,16.76
  pour Top: 0,59.94 72.14,59.94 72.14,-1.02 0,-1.02
  pour Bottom: 72.14,60.45 0,60.45 0,0 72.14,0
L
  Top 0.203: R6.1 31.5,46.74 32,47.24 33.02,47.24 38.12,52.35 43.49,52.35 44.34,53.2 J1.3
LINE_IN_L
  Top 0.203: R11.1-3 3.56,7.75 1.17,10.14 1.17,42.82 2.54,44.2 14.73,44.2 15.75,45.21 27.43,45.21 | 27.43,45.21 R3.2 | 27.43,45.21 29.46,45.21 30.31,44.36 R6.2
LINE_IN_R
  Top 0.203: R4.2 19.3,42.16 | 19.3,42.16 18.29,42.16 15.75,39.62 9.14,39.62 4.06,34.54 R10.1-3 | 19.3,42.16 33.02,42.16 33.53,42.67 R5.2
N$1
  Top 0.203: IC2.9 13.21,20.83 12.7,20.32 12.7,18.8 | 12.7,18.8 13.21,18.29 C8.1 | 12.7,18.8 R11.2-1 R11.1-2
N$2
  Top 0.203: R10.2-1 8.05,42.08 4.06,38.1 R10.1-2 2.54,35.56 2.54,31.5 5.08,28.96 9.65,28.96 12.7,25.91 IC2.13 15.24,25.91 15.75,26.42 15.75,27.43 16.26,27.94 C7.1
N$3
  Top 0.203: R14.2 R17.1 19.98,16.26 20.2,16.47 C8.2 18.92,18.29 18.8,18.41 18.8,19.81 | C12.1 18.67,21.34 18.8,21.21 18.8,19.81 | IC2.8 16,19.56 16.26,19.81 18.8,19.81
N$4
  Top 0.203: IC2.14 14.99,27.18 15.24,27.43 15.24,28.96 15.75,29.46 18.8,29.46 | 18.8,29.46 18.8,27.94 | 18.8,27.94 18.8,25.4 18.29,24.89 C11.1 | 18.8,29.46 18.8,29.97 18.63,30.14 R15.2 R16.1 | C7.2 18.8,27.94
N$5
  Top 0.203: R16.2 23.24,30.99 C14.1 23.49,30.99 R20.1
N$6
  Top 0.203: R10.2-2 9.57,37.08 15.67,30.99 R15.1
N$7
  Top 0.203: R21.1 23.49,15.24 C15.1 23.24,15.24 R17.2
N$8
  Top 0.203: C11.2 21.84,24.89 22.19,24.55 R18.2 24.04,24.55 24.38,24.89 C16.1
N$9
  Top 0.203: C17.1 24.38,21.34 24.04,21.68 R19.2 22.19,21.68 21.84,21.34 C12.2
N$10
  Top 0.203: J2.2 J2.3 18.99,48.07 19.3,47.75 R4.1
N$11
  Top 0.203: J3.2 27.43,50.15 | 27.43,50.15 J3.3 | R3.1 27.43,50.15
N$12
  Top 0.203: R13.2 R12.1 6.77,27.27 8.13,25.91 IC2.2
N$13
  Top 0.203: R23.2 R26.1 36.23,13.84 36.41,14.02 39.44,14.02 40.33,13.21 IC3.6
N$14
  Top 0.203: IC3.2 43.18,18.29 43.69,18.8 R25.1 R22.2
N$15
  Top 0.203: R27.2 50.93,12.19 50.8,12.06 50.8,10.29 50.67,10.16 R35.1 49.28,10.16 48.77,10.67 48.77,12.7 48.26,13.21 IC3.9
N$16
  Top 0.203: R37.1 53,11.34 52.83,11.18 51.82,11.18 51.65,11.01 R35.2 51.65,9.49 51.31,9.14 47.75,9.14 47.18,9.72 IC3.8
N$17  (via drill 0.35)
  Top 0.203: v52.32,16.13 52.32,17.23 52.28,17.27 R28.2 R31.1 | IC3.10 v45.59,14.48
  Bottom 0.203: v45.59,14.48 47.24,16.13 v52.32,16.13
N$18
  Top 0.203: R29.2 50.93,19.3 50.8,19.43 50.8,21.21 50.67,21.34 R36.1 49.28,21.34 48.77,20.83 48.77,18.8 48.26,18.29 IC3.13
N$19
  Top 0.203: R38.1 53,20.15 52.83,20.32 51.82,20.32 51.65,20.49 R36.2 51.65,22.01 51.31,22.35 48.26,22.35 47.18,21.27 IC3.14
N$20
  Top 0.203: IC3.12 48.51,17.02 49.78,15.75 51.31,15.75 51.65,15.41 R30.2 R33.1
N$21
  Top 0.203: R28.1 49.95,18.29 | 49.95,18.29 R29.1 | R25.2 42.51,23.2 42.16,22.86 42.16,19.62 IC3.1 41.53,19.56 40.89,18.92 40.89,18.16 41.32,17.73 48.21,17.73 48.77,18.29 49.95,18.29
N$22
  Top 0.203: R30.1 49.95,13.21 | 49.95,13.21 R27.1 | R26.2 38.82,13.21 40.09,11.94 IC3.7 44.45,11.94 44.7,12.19 44.7,13.21 45.26,13.76 48.72,13.76 49.27,13.21 49.95,13.21
N$23
  Top 0.203: C20.1 R24.2 36.23,20.66 36.36,20.53 39.54,20.53 40.13,19.94 40.13,18.29 41.4,17.02 IC3.3
N$24
  Top 0.203: R23.1 37.93,10.38 37.47,9.91 34.55,9.91 34.42,10.03 C21.1
N$25
  Top 0.203: R40.2 R43.1 36.23,27.56 36.41,27.74 39.44,27.74 40.33,26.92 IC4.6
N$26
  Top 0.203: IC4.2 43.18,32 43.69,32.51 R42.1 R39.2
N$27
  Top 0.203: R44.2 50.93,25.91 50.8,25.78 50.8,24 50.67,23.88 R52.1 49.28,23.88 48.77,24.38 48.77,26.42 48.26,26.92 IC4.9
N$28
  Top 0.203: R54.1 53,25.06 52.83,24.89 51.82,24.89 51.65,24.73 R52.2 51.65,23.2 51.31,22.86 47.75,22.86 47.18,23.43 IC4.8
N$29  (via drill 0.35)
  Top 0.203: R45.2 52.32,30.99 | 52.32,30.99 v52.32,29.46 | v48.77,28.45 48.51,28.19 IC4.10 | 52.32,30.99 R48.1
  Bottom 0.203: v48.77,28.45 49.78,29.46 v52.32,29.46
N$30
  Top 0.203: R46.2 50.93,33.02 50.8,33.15 50.8,34.92 50.67,35.05 R53.1 49.28,35.05 48.77,34.54 48.77,32.51 48.26,32 IC4.13
N$31
  Top 0.203: R55.1 53,33.87 52.83,34.04 51.82,34.04 51.65,34.2 R53.2 51.65,35.73 51.31,36.07 48.26,36.07 47.18,34.98 IC4.14
N$32
  Top 0.203: IC4.12 48.01,30.73 49.28,29.46 51.31,29.46 51.65,29.12 R47.2 R50.1
N$33
  Top 0.203: R45.1 49.95,32 | 49.95,32 R46.1 | R42.2 42.51,36.92 42.16,36.58 42.16,33.34 IC4.1 41.53,33.27 40.89,32.64 40.89,31.87 41.32,31.45 48.21,31.45 48.77,32 49.95,32
N$34
  Top 0.203: R47.1 49.95,26.92 | 49.95,26.92 R44.1 | R43.2 38.82,26.92 40.09,25.65 IC4.7 44.45,25.65 44.7,25.91 44.7,26.92 45.26,27.48 48.72,27.48 49.27,26.92 49.95,26.92
N$35
  Top 0.203: C27.1 R41.2 36.23,34.38 36.36,34.25 39.54,34.25 40.13,33.66 40.13,32 41.4,30.73 IC4.3
N$36
  Top 0.203: R40.1 37.93,24.09 37.47,23.62 34.55,23.62 34.42,23.75 C28.1
N$37
  Top 0.203: CON1.P$3 65.02,23.37 66.42,24.77 C18.2
N$38
  Top 0.508: J4.3 J4.2
N$39
  Top 0.203: R2.1 23.03,46.06 21.34,47.75 21.34,50.8 24.38,53.85 J3.1
N$40
  Top 0.203: R1.1 17.27,46.82 17.02,47.08 10.33,47.08 9.14,48.26 9.14,51.31 11.68,53.85 J2.1
N$41
  Top 0.508: D1.2 55.37,44.2 56,44.83 | 56,44.83 C1.1 | C1.1 C3.1 C2.1 | C1.1 65.02,42.46 IC1.3 | J4.1 56.15,44.98 56,44.83
N$42
  Top 0.203: R11.2-2 14.14,15.24 R14.1
N$43
  Top 0.508: R9.2 R8.1 65.37,34.2 65,34.57 IC1.1
N$44
  Top 0.203: CON2.P$3 65.53,11.18 66.93,12.58 C19.2
N$45  (via drill 3.2 pad 6)
  other vias: 4.5,55.5
N$46  (via drill 3.2 pad 6)
  other vias: 14.5,4.5
N$47  (via drill 3.2 pad 6)
  other vias: 67.5,4.5
N$48  (via drill 3.2 pad 6)
  other vias: 67.5,55.5
N$49  (via drill 0.36)
  other vias: 2.54,2.54
N$53  (via drill 0.36)
  other vias: 66.04,17.78
R
  Top 0.203: R5.1 33.53,46.74 34.33,47.54 J1.2 39.16,47.54 39.83,46.87 40.5,46.87 41.39,45.99 J1.4
SCHIRMUNG
  Top 0.203: R7.1 36.73,56.73 J1.1
VREF_2V  (via drill 0.35, 0.36)
  Top 0.406: IC3.5 v40.51,14.48 | v39.62,21.34 R24.1 | R22.1 v45.72,24.38 | R34.2 53,8.8 52.83,8.64 43.18,8.64 v41.15,10.67 | IC4.5 v40.51,28.19 | R41.1 v39.62,35.05 39.62,36.07 41.66,38.1 45.72,38.1 | R39.1 45.72,38.1 | 45.72,38.1 46.23,38.1 46.99,37.34 52.24,37.34 53,36.58 R49.2 | R51.2 52.96,23.84 v52.96,22.61 52.96,21.38 R32.2
  Top 0.508: IC2.3 10.92,24.64 v11.18,24.89 11.18,26.42 10.41,27.18 IC2.1
  Bottom 0.406: 40.51,21.34 v40.51,14.48 40.51,11.3 v41.15,10.67 | v39.62,21.34 40.51,21.34 | v39.62,35.05 40.51,34.16 v40.51,28.19 40.51,24.38 | 40.51,24.38 40.51,21.34 | v52.96,22.61 51.18,24.38 v45.72,24.38 44.22,24.38 43.99,24.16 43.38,24.16 43.15,24.38 40.51,24.38
  Bottom 0.508: v11.18,24.89 14.22,24.89 17.78,21.34 v39.62,21.34

### Text on the board
tPlace: designed by brokulp / https://github.com/BrokuLP / LineToBalancedAdapter-rev1